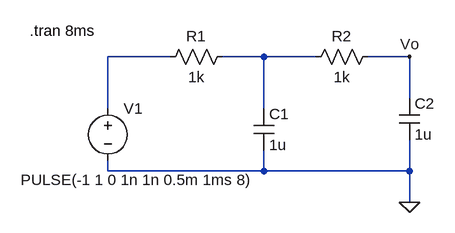
[diagram p0: schematic pulsetosinewavegen.asc]
pulsetosinewavegen.asc, the LTspice schematic file:
Version 4.1
SHEET 1 880 680
WIRE 128 48 32 48
WIRE 272 48 208 48
WIRE 352 48 272 48
WIRE 496 48 432 48
WIRE 496 112 496 48
WIRE 32 128 32 48
WIRE 272 128 272 48
WIRE 32 224 32 208
WIRE 272 224 272 192
WIRE 272 224 32 224
WIRE 496 224 496 176
WIRE 496 224 272 224
WIRE 496 272 496 224
FLAG 496 272 0
FLAG 496 48 Vo
SYMBOL voltage 32 112 R0
WINDOW 3 -134 126 Left 2
WINDOW 123 0 0 Left 0
WINDOW 39 0 0 Left 0
SYMATTR InstName V1
SYMATTR Value PULSE(-1 1 0 1n 1n 0.5m 1ms 8)
SYMBOL res 224 32 R90
WINDOW 0 0 56 VBottom 2
WINDOW 3 32 56 VTop 2
SYMATTR InstName R1
SYMATTR Value 1k
SYMBOL cap 256 128 R0
SYMATTR InstName C1
SYMATTR Value 1u
SYMBOL res 448 32 R90
WINDOW 0 0 56 VBottom 2
WINDOW 3 32 56 VTop 2
SYMATTR InstName R2
SYMATTR Value 1k
SYMBOL cap 480 112 R0
SYMATTR InstName C2
SYMATTR Value 1u
TEXT -88 8 Left 2 !.tran 8ms

The netlist it stands for:
* pulsetosinewavegen.asc
V1 N001 0 PULSE(-1 1 0 1n 1n 0.5m 1ms 8)
R1 N002 N001 1k
C1 N002 0 1u
R2 Vo N002 1k
C2 Vo 0 1u
.tran 8ms
.backanno
.end